# Altium schematic sheet RadioPod_3.SchDoc
size A4
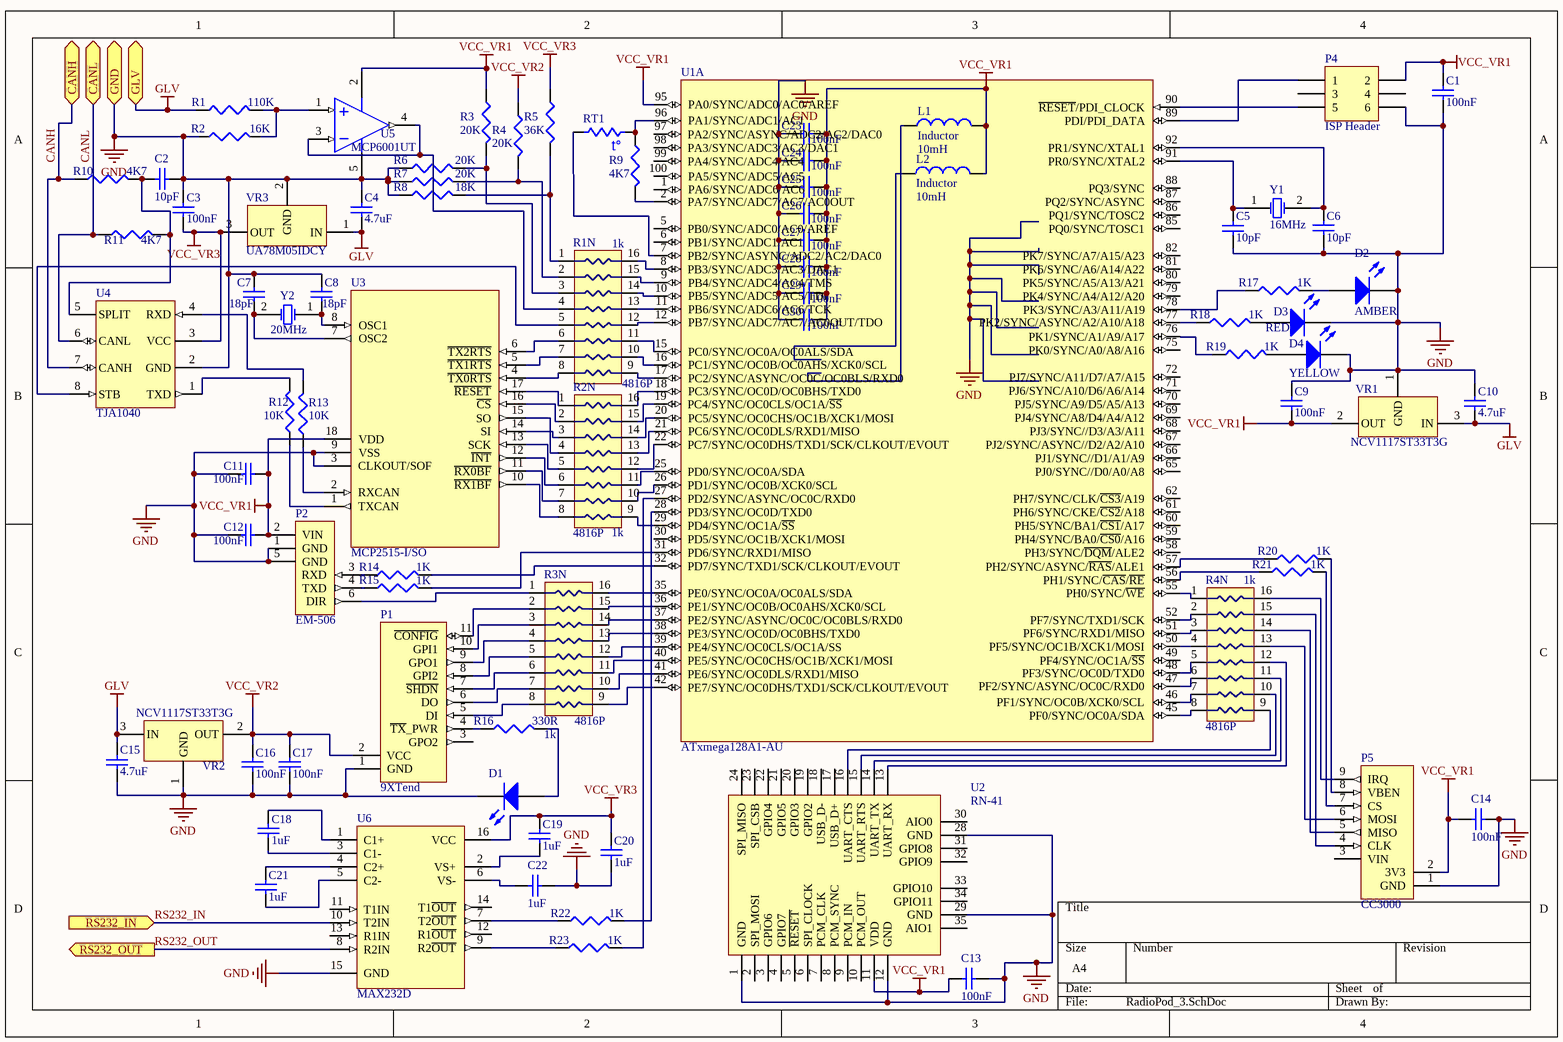
[diagram p0: RadioPod_3.SchDoc]

## Parts
C1  value 100nF  [1608[0603]]  (hidden comment: Cap Semi)
C2  value 10pF  [1608[0603]]  (hidden comment: Cap Semi)
C3  value 100nF  [1608[0603]]  (hidden comment: Cap Semi)
C4  value 4.7uF  [1608[0603]]  (hidden comment: Cap Semi)
C5  value 10pF  [1608[0603]]  (hidden comment: Cap Semi)
C6  value 10pF  [1608[0603]]  (hidden comment: Cap Semi)
C7  value 18pF  [1608[0603]]  (hidden comment: Cap Semi)
C8  value 18pF  [1608[0603]]  (hidden comment: Cap Semi)
C9  value 100nF  [1608[0603]]  (hidden comment: Cap Semi)
C10  value 4.7uF  [1608[0603]]  (hidden comment: Cap Semi)
C11  value 100nF  [1608[0603]]  (hidden comment: Cap Semi)
C12  value 100nF  [1608[0603]]  (hidden comment: Cap Semi)
C13  value 100nF  [1608[0603]]  (hidden comment: Cap Semi)
C14  value 100nF  [1608[0603]]  (hidden comment: Cap Semi)
C15  value 4.7uF  [1608[0603]]  (hidden comment: Cap Semi)
C16  value 100nF  [1608[0603]]  (hidden comment: Cap Semi)
C17  value 100nF  [1608[0603]]  (hidden comment: Cap Semi)
C18  value 1uF  [1608[0603]]  (hidden comment: Cap Semi)
C19  value 1uF  [1608[0603]]  (hidden comment: Cap Semi)
C20  value 1uF  [1608[0603]]  (hidden comment: Cap Semi)
C21  value 1uF  [1608[0603]]  (hidden comment: Cap Semi)
C22  value 1uF  [1608[0603]]  (hidden comment: Cap Semi)
C23  value 100nF  [1608[0603]]  (hidden comment: Cap Semi)
C24  value 100nF  [1608[0603]]  (hidden comment: Cap Semi)
C25  value 100nF  [1608[0603]]  (hidden comment: Cap Semi)
C26  value 100nF  [1608[0603]]  (hidden comment: Cap Semi)
C27  value 100nF  [1608[0603]]  (hidden comment: Cap Semi)
C28  value 100nF  [1608[0603]]  (hidden comment: Cap Semi)
C29  value 100nF  [1608[0603]]  (hidden comment: Cap Semi)
C30  value 100nF  [1608[0603]]  (hidden comment: Cap Semi)
D1  LED2  [2012[0805]_LED]  (value not drawn)
D2  AMBER  [hdr1x2]
D3  RED  [2012[0805]_LED]
D4  YELLOW  [2012[0805]_LED]
L1  Inductor  value 10mH  [2012[0805]_IND]
L2  Inductor  value 10mH  [2012[0805]_IND]
P1  9XTend  [9XTend Header]
P2  EM-506  [EM_506]
P4  ISP Header  [ISP Header]
P5  CC3000  [hdr1X9]
R1  value 110K  [2012[0805]_RES]  (hidden comment: Res3)
R1N  4816P  Resistance: 1k  [SOIC16_L]
R2  value 16K  [2012[0805]_RES]  (hidden comment: Res3)
R2N  4816P  Resistance: 1k  [SOIC16_L]
R3  value 20K  [2012[0805]_RES]  (hidden comment: Res3)
R3N  4816P  Resistance: 1k  [SOIC16_L]
R4  value 20K  [2012[0805]_RES]  (hidden comment: Res3)
R4N  4816P  Resistance: 1k  [SOIC16_L]
R5  value 36K  [2012[0805]_RES]  (hidden comment: Res3)
R6  value 20K  [2012[0805]_RES]  (hidden comment: Res3)
R7  value 20K  [2012[0805]_RES]  (hidden comment: Res3)
R8  value 18K  [2012[0805]_RES]  (hidden comment: Res3)
R9  value 4K7  [2012[0805]_RES]  (hidden comment: Res3)
R10  value 4K7  [2012[0805]_RES]  (hidden comment: Res3)
R11  value 4K7  [2012[0805]_RES]  (hidden comment: Res3)
R12  value 10K  [2012[0805]_RES]  (hidden comment: Res3)
R13  value 10K  [2012[0805]_RES]  (hidden comment: Res3)
R14  value 1K  [2012[0805]_RES]  (hidden comment: Res3)
R15  value 1K  [2012[0805]_RES]  (hidden comment: Res3)
R16  value 330R  [2012[0805]_RES]  (hidden comment: Res3)
R17  value 1K  [2012[0805]_RES]  (hidden comment: Res3)
R18  value 1K  [2012[0805]_RES]  (hidden comment: Res3)
R19  value 1K  [2012[0805]_RES]  (hidden comment: Res3)
R20  value 1K  [2012[0805]_RES]  (hidden comment: Res3)
R21  value 1K  [2012[0805]_RES]  (hidden comment: Res3)
R22  value 1K  [2012[0805]_RES]  (hidden comment: Res3)
R23  value 1K  [2012[0805]_RES]  (hidden comment: Res3)
RT1  Res Thermal  [2012[0805]_RES]  (value not drawn)
U1  ATxmega128A1-AU  [100A_N]  (part A of 2)
U2  RN-41  [RN41]
U3  MCP2515-I/SO  [SOIC-SO18_N]
U4  TJA1040  [SO8_L]
U5  MCP6001UT  [SOT-23-OT5_N]
U6  MAX232D  [D016_M]
VR1  NCV1117ST33T3G  [SOT223_L]
VR2  NCV1117ST33T3G  [SOT223_L]
VR3  UA78M05IDCY  [SOT223_L]
Y1  16MHz  [Crystal]
Y2  20MHz  [MCP2515_XTAL]

## Ports
CANH (bidir), CANL (bidir), GLV, GND, RS232_IN (in), RS232_OUT (out)

## Nets
GLV: C4.1 C10.1 C15.2 R1.1 VR1.3(IN) VR2.3(IN) VR3.1(IN) ; port GLV
GND: C1.1 C2.1 C3.2 C4.2 C5.2 C6.2 C7.2 C8.2 C9.2 C10.2 C11.2 C12.2 C13.2 C14.2 C15.1 C16.1 C17.1 C20.1 C22.1 C23.2 C24.2 C25.2 C26.2 C27.2 C28.2 C29.2 C30.2 D1.2(K) D2.2(K) D3.2(K) D4.2(K) P1.1(GND) P2.1(GND) P2.5(GND) P4.6 P5.1(GND) R2.1 R6.1 R7.1 R8.1 U2.1(GND) U2.12(GND) U2.28(GND) U2.29(GND) U3.3(CLKOUT/SOF) U3.9(VSS) U4.2(GND) U5.5(VDD) U6.15(GND) VR1.1(GND) VR2.1(GND) VR3.2(GND) ; port GND
VCC_VR1: C1.2 C9.1 C11.1 C12.1 C13.1 C14.1 C23.1 C24.1 C25.1 C26.1 C27.1 C28.1 C29.1 C30.1 L1.2 L2.2 P2.2(VIN) P4.2 P5.2(3V3) R3.1 U1.95(PA0/SYNC/ADC0/AC0/AREF) U2.11(VDD) U3.18(VDD) U5.2(VSS) VR1.2(OUT)
VCC_VR2: C16.2 C17.2 P1.2(VCC) R4.1 VR2.2(OUT)
VCC_VR3: C3.1 C19.2 C20.2 R5.1 U4.3(VCC) U6.16(VCC) VR3.3(OUT)
CANH: R10.1 U4.7(CANH) ; port CANH
CANL: R11.1 U4.6(CANL) ; port CANL
RS232_IN: U6.10(T2IN) ; port RS232_IN
RS232_OUT: U6.8(R2IN) ; port RS232_OUT
NetC2_2: C2.2 R10.2 R11.2 U4.5(SPLIT)
NetC5_1: C5.1 U1.91(PR0/SYNC/XTAL2) Y1.1(OSC1)
NetC6_1: C6.1 U1.92(PR1/SYNC/XTAL1) Y1.2(OSC2)
NetC7_1: C7.1 U3.7(OSC2) Y2.2(OSC2)
NetC8_1: C8.1 U3.8(OSC1) Y2.1(OSC1)
NetC18_1: C18.1 U6.3(C1-)
NetC18_2: C18.2 U6.1(C1+)
NetC19_1: C19.1 U6.2(VS+)
NetC21_1: C21.1 U6.5(C2-)
NetC21_2: C21.2 U6.4(C2+)
NetC22_2: C22.2 U6.6(VS-)
NetD1_1: D1.1(A) R16.2
NetD2_1: D2.1(A) R17.2
NetD3_1: D3.1(A) R18.2
NetD4_1: D4.1(A) R19.2
NetP1_4: P1.4(~{TX}_PWR) R16.1
NetP1_5: P1.5(DI) R3N.8
NetP1_6: P1.6(DO) R3N.7
NetP1_7: P1.7(~{SHDN}) R3N.6
NetP1_8: P1.8(GPI2) R3N.5
NetP1_9: P1.9(GPO1) R3N.4
NetP1_10: P1.10(GPI1) R3N.3
NetP1_11: P1.11(~{CONFIG}) R3N.2
NetP2_3: P2.3(RXD) R14.1
NetP2_4: P2.4(TXD) R15.1
NetP2_6: P2.6(DIR) R3N.1
NetP4_1: P4.1 U1.89(PDI/PDI_DATA)
NetP4_5: P4.5 U1.90(~{RESET}/PDI_CLOCK)
NetP5_4: P5.4(CLK) R4N.15
NetP5_5: P5.5(MISO) R4N.14
NetP5_6: P5.6(MOSI) R4N.13
NetP5_7: P5.7(CS) R21.2
NetP5_8: P5.8(VBEN) R20.2
NetP5_9: P5.9(IRQ) R4N.16
NetR1_2: R1.2 R2.2 U5.1(VIN+)
NetR1N_1: R1N.1 R5.2 R8.2
NetR1N_2: R1N.2 R4.2 R7.2
NetR1N_3: R1N.3 R3.2 R6.2
NetR1N_4: R1N.4 U5.3(VIN-) U5.4(VOUT)
NetR1N_5: R1N.5 U4.8(STB)
NetR1N_6: R1N.6 U3.6(~{TX2RTS})
NetR1N_7: R1N.7 U3.5(~{TX1RTS})
NetR1N_8: R1N.8 U3.4(~{TX0RTS})
NetR1N_9: R1N.9 U1.17(PC2/SYNC/ASYNC/OC0C/OC0BLS/RXD0)
NetR1N_10: R1N.10 U1.16(PC1/SYNC/OC0B/OC0AHS/XCK0/SCL)
NetR1N_11: R1N.11 U1.15(PC0/SYNC/OC0A/OC0ALS/SDA)
NetR1N_12: R1N.12 U1.12(PB7/SYNC/ADC7/AC7/AC0OUT/TDO)
NetR1N_13: R1N.13 U1.11(PB6/SYNC/ADC6/AC6/TCK)
NetR1N_14: R1N.14 U1.10(PB5/SYNC/ADC5/AC5/TDI)
NetR1N_15: R1N.15 U1.9(PB4/SYNC/ADC4/AC4/TMS)
NetR1N_16: R1N.16 U1.8(PB3/SYNC/ADC3/AC3/DAC1)
NetR2N_1: R2N.1 U3.17(~{RESET})
NetR2N_2: R2N.2 U3.16(~{CS})
NetR2N_3: R2N.3 U3.14(SI)
NetR2N_4: R2N.4 U3.15(SO)
NetR2N_5: R2N.5 U3.13(SCK)
NetR2N_6: R2N.6 U3.12(~{INT})
NetR2N_7: R2N.7 U3.11(~{RX0BF})
NetR2N_8: R2N.8 U3.10(~{RX1BF})
NetR2N_9: R2N.9 U1.29(PD4/SYNC/OC1A/~{SS})
NetR2N_10: R2N.10 U1.26(PD1/SYNC/OC0B/XCK0/SCL)
NetR2N_11: R2N.11 U1.25(PD0/SYNC/OC0A/SDA)
NetR2N_12: R2N.12 U1.22(PC7/SYNC/OC0DHS/TXD1/SCK/CLKOUT/EVOUT)
NetR2N_13: R2N.13 U1.21(PC6/SYNC/OC0DLS/RXD1/MISO)
NetR2N_14: R2N.14 U1.20(PC5/SYNC/OC0CHS/OC1B/XCK1/MOSI)
NetR2N_15: R2N.15 U1.19(PC4/SYNC/OC0CLS/OC1A/~{SS})
NetR2N_16: R2N.16 U1.18(PC3/SYNC/OC0D/OC0BHS/TXD0)
NetR3N_9: R3N.9 U1.42(PE7/SYNC/OC0DHS/TXD1/SCK/CLKOUT/EVOUT)
NetR3N_10: R3N.10 U1.41(PE6/SYNC/OC0DLS/RXD1/MISO)
NetR3N_11: R3N.11 U1.40(PE5/SYNC/OC0CHS/OC1B/XCK1/MOSI)
NetR3N_12: R3N.12 U1.39(PE4/SYNC/OC0CLS/OC1A/SS)
NetR3N_13: R3N.13 U1.38(PE3/SYNC/OC0D/OC0BHS/TXD0)
NetR3N_14: R3N.14 U1.37(PE2/SYNC/ASYNC/OC0C/OC0BLS/RXD0)
NetR3N_15: R3N.15 U1.36(PE1/SYNC/OC0B/OC0AHS/XCK0/SCL)
NetR3N_16: R3N.16 U1.35(PE0/SYNC/OC0A/OC0ALS/SDA)
NetR4N_1: R4N.1 U1.55(PH0/SYNC/~{WE})
NetR4N_2: R4N.2 U1.52(PF7/SYNC/TXD1/SCK)
NetR4N_3: R4N.3 U1.51(PF6/SYNC/RXD1/MISO)
NetR4N_4: R4N.4 U1.50(PF5/SYNC/OC1B/XCK1/MOSI)
NetR4N_5: R4N.5 U1.48(PF3/SYNC/OC0D/TXD0)
NetR4N_6: R4N.6 U1.47(PF2/SYNC/ASYNC/OC0C/RXD0)
NetR4N_7: R4N.7 U1.46(PF1/SYNC/OC0B/XCK0/SCL)
NetR4N_8: R4N.8 U1.45(PF0/SYNC/OC0A/SDA)
NetR4N_9: R4N.9 U2.16(UART_CTS)
NetR4N_10: R4N.10 U2.15(UART_RTS)
NetR4N_11: R4N.11 U2.14(UART_TX)
NetR4N_12: R4N.12 U2.13(UART_RX)
NetR9_1: R9.1 RT1.1 U1.96(PA1/SYNC/ADC1/AC1)
NetR9_2: R9.2 U1.2(PA7/SYNC/ADC7/AC7/AC0OUT)
NetR12_1: R12.1 U3.1(TXCAN)
NetR12_2: R12.2 U4.1(TXD)
NetR13_1: R13.1 U3.2(RXCAN)
NetR13_2: R13.2 U4.4(RXD)
NetR14_2: R14.2 U1.32(PD7/SYNC/TXD1/SCK/CLKOUT/EVOUT)
NetR15_2: R15.2 U1.31(PD6/SYNC/RXD1/MISO)
NetR17_1: R17.1 U1.78(PK3/SYNC/A3/A11/A19)
NetR18_1: R18.1 U1.77(PK2/SYNC/ASYNC/A2/A10/A18)
NetR19_1: R19.1 U1.76(PK1/SYNC/A1/A9/A17)
NetR20_1: R20.1 U1.57(PH2/SYNC/ASYNC/~{RAS}/ALE1)
NetR21_1: R21.1 U1.56(PH1/SYNC/~{CAS}/~{RE})
NetR22_1: R22.1 U6.7(T2~{OUT})
NetR22_2: R22.2 U1.28(PD3/SYNC/OC0D/TXD0)
NetR23_1: R23.1 U6.9(R2~{OUT})
NetR23_2: R23.2 U1.27(PD2/SYNC/ASYNC/OC0C/RXD0)
NetRT1_2: RT1.2 U1.7(PB2/SYNC/ASYNC/ADC2/AC2/DAC0)

Not connected (* = marked no-connect by the designer): L1 1; L2 1; P1 3(GPO2); P4 3 4; P5 3(VIN); U1 1(PA6/SYNC/ADC6/AC6) 5(PB0/SYNC/ADC0/AC0/AREF) 6(PB1/SYNC/ADC1/AC1) 30(PD5/SYNC/OC1B/XCK1/MOSI) 49(PF4/SYNC/OC1A/~{SS}) 58(PH3/SYNC/~{DQM}/ALE2) 59(PH4/SYNC/BA0/~{CS0}/A16) 60(PH5/SYNC/BA1/~{CS1}/A17) 61(PH6/SYNC/CKE/~{CS2}/A18) 62(PH7/SYNC/CLK/~{CS3}/A19) 65(PJ0/SYNC//D0/A0/A8) 66(PJ1/SYNC//D1/A1/A9) 67(PJ2/SYNC/ASYNC//D2/A2/A10) 68(PJ3/SYNC//D3/A3/A11) 69(PJ4/SYNC/A8/D4/A4/A12) 70(PJ5/SYNC/A9/D5/A5/A13) 71(PJ6/SYNC/A10/D6/A6/A14) 72(PJ7/SYNC/A11/D7/A7/A15) 75(PK0/SYNC/A0/A8/A16) 79(PK4/SYNC/A4/A12/A20) 80(PK5/SYNC/A5/A13/A21) 81(PK6/SYNC/A6/A14/A22) 82(PK7/SYNC/A7/A15/A23) 85(PQ0/SYNC/TOSC1) 86(PQ1/SYNC/TOSC2) 87(PQ2/SYNC/ASYNC) 88(PQ3/SYNC) 97(PA2/SYNC/ASYNC/ADC2/AC2/DAC0) 98(PA3/SYNC/ADC3/AC3/DAC1) 99(PA4/SYNC/ADC4/AC4) 100(PA5/SYNC/ADC5/AC5); U2 2(SPI_MOSI) 3(GPIO6) 4(GPIO7) 5(~{RESET}) 6(SPI_CLOCK) 7(PCM_CLK) 8(PCM_SYNC) 9(PCM_IN) 10(PCM_OUT) 17(USB_D+) 18(USB_D-) 19(GPIO2) 20(GPIO3) 21(GPIO5) 22(GPIO4) 23(SPI_CSB) 24(SPI_MISO) 30(AIO0) 31(GPIO8) 32(GPIO9) 33(GPIO10) 34(GPIO11) 35(AIO1); U6 11(T1IN) 12(R1~{OUT}) 13(R1IN) 14(T1~{OUT}); VR1 4; VR2 4; VR3 4(GND)

## Notes on the sheet
- (in symbol Res Thermal) t°

## Library data of the parts
C1-C30 = Cap Semi: Capacitor (Semiconductor SIM Model); Published: 8-Jun-2000; LatestRevisionDate: 29-May-2009; LatestRevisionNote: IPC-7351 Footprint Added.; PackageReference: C1206; Publisher: Altium Limited; PackageDescription: Chip Capacitor
D1 D3 D4 = LED2: Typical RED, GREEN, YELLOW, AMBER GaAs LED; Published: 8-Jun-2000; LatestRevisionDate: 17-Jul-2002; LatestRevisionNote: Re-released for DXP Platform.; PackageVersion: Feb-2002; PackageReference: 3.2X1.6X1.1; Publisher: Altium Limited; PackageDescription: SM LED; 2 Flat Leads
D2 = LED0: Typical INFRARED GaAs LED; Published: 8-Jun-2000; LatestRevisionDate: 08-Jul-2005; LatestRevisionNote: Mech Layer 1 removed.; PackageReference: LED-0; Publisher: Altium Limited; PackageDescription: LED; 2 Leads
L1 L2 = Inductor: Code_IEC: 1005; Published: 8-Jun-2000; LatestRevisionDate: 29-May-2009; LatestRevisionNote: IPC-7351 Footprint Added.; PackageReference: 0402-A; Publisher: Altium Limited; PackageDescription: Chip Inductor; Code_JEITA: 0402
P1 = 9XTend: 9XTend Header Pins
P2 = EM-506: EM-506 GPS Module Pads
P4 = Header 3X2: Header, 3-Pin, Dual row; LatestRevisionDate: 17-Jul-2002; LatestRevisionNote: Re-released for DXP Platform.; Publisher: Altium Limited
P5 = CC3000: CC3000 Wifi Module
R1-R23 = Res3: Resistor; Published: 8-Jun-2000; LatestRevisionDate: 29-May-2009; LatestRevisionNote: IPC-7351 Footprint Added.; PackageReference: J1-0603; Publisher: Altium Limited; PackageDescription: Chip Resistor
R1N R2N R3N R4N = 4816P: Resistor Network SOIC-16 package
RT1 = Res Thermal: Thermistor; Published: 24-Mar-1999; LatestRevisionDate: 29-May-2009; LatestRevisionNote: IPC-7351 Footprint Added.; PackageVersion: Mar-2003; PackageReference: 6-0805; Publisher: Altium Limited; PackageDescription: Chip Resistor 0805 Case Size; Code_IPC: RESC2012
U1 = ATxmega128A1-AU: 8/16-bit AVR XMEGA A1 Microcontroller, 1.6-3.6V, 128KB + 8KB Flash, 2KB EEPROM, 8KB SRAM, 100-pin TQFP, Industrial Grade (-40°C to 85°C), Pb-Free; Published: 1-Apr-2010; DatasheetVersion: revK, Feb-2010; PackageVersion: revC, Oct-2001; PackageReference: 100A; Publisher: Altium Limited; PackageDescription: 100-Pin Thin Profile Plastic Quad Flat Pack (TQFP), 14 x 14 x 1.0 mm Body, 0.5 mm Pitch; Supplier 1: Digi-Key; Supplier Part Number 1: ATXMEGA128A1-AU-ND; Supplier 2: Farnell; Supplier Part Number 2: 1704571; Supplier 3: Mouser; Supplier Part Number 3: 556-ATXMEGA128A1-AU; Code_JEDEC: MS-026-AED; ComponentLink1Description: Manufacturer Link; ComponentLink1URL: http://www.atmel.com/products/avr/default.asp?; ComponentLink2Description: ATxmega64A1/128A1/192A1/256A1/384A1 Datasheet; ComponentLink2URL: http://www.atmel.com/dyn/resources/prod_documents/doc8067.pdf; ComponentLink3Description: Atmel.com Home; ComponentLink3URL: http://www.atmel.com
U2 = RN41: RN-41 Bluetooth Module
U3 = MCP2515-I/SO: Stand-Alone CAN Controller With SPI Interface, 18-Pin SOIC, Industrial Temperature; Published: 29-Jan-2009; DatasheetVersion: revE, Nov-2007; PackageVersion: revBB, Aug-2009; PackageReference: SOIC-SO18; Publisher: Altium Limited; PackageDescription: 18-Lead Plastic Small Outline (SO) - Wide 7.50mm Body [SOIC]; Supplier 1: Digi-Key; Supplier Part Number 1: MCP2515-I/SO-ND; Supplier 2: Farnell; Supplier Part Number 2: 1292239; Code_JEDEC: MS-013; ComponentLink1Description: Datasheet; ComponentLink1URL: http://ww1.microchip.com/downloads/en/DeviceDoc/21801e.pdf; ComponentLink2Description: Packaging Specification; ComponentLink2URL: http://www.microchip.com/stellent/groups/techpub_sg/documents/packagingspec/en012702.pdf; ComponentLink3Description: Microchip.com Home; ComponentLink3URL: http://www.microchip.com/
U5 = MCP6001UT-I/OT: 1 MHz, Low-Power Operational Amplifier, 5-Pin SOT-23, Industrial Temperature, Tape and Reel; Published: 29-Jan-2009; LatestRevisionDate: 02-Dec-2009; LatestRevisionNote: Updated to datasheet revision J, Nov-2009; DatasheetVersion: revJ, Nov-2009; PackageVersion: revBB, Aug-2009; PackageReference: SOT-23-OT5; Publisher: Altium Limited; PackageDescription: 5-Lead Plastic Small Outline Transistor (OT) [SOT-23]; Supplier 1: Digi-Key; Supplier Part Number 1: MCP6001UT-I/OTTR-ND; Supplier 2: Digi-Key; Supplier Part Number 2: MCP6001UT-I/OTCT-ND; Supplier 3: Digi-Key; Supplier Part Number 3: MCP6001UT-I/OTDKR-ND; Supplier 4: Farnell; Supplier Part Number 4: 8540845; Code_IPC: SOT23-5; ComponentLink1Description: Datasheet; ComponentLink1URL: http://ww1.microchip.com/downloads/en/DeviceDoc/21733j.pdf; ComponentLink2Description: Packaging Specification; ComponentLink2URL: http://www.microchip.com/stellent/groups/techpub_sg/documents/packagingspec/en012702.pdf; ComponentLink3Description: Microchip.com Home; ComponentLink3URL: http://www.microchip.com/
U6 = MAX232D: Dual EIA-232 Driver/Receiver; Note: Receivers have typical hysteresis of 0.5V; Published: 15-May-2002; LatestRevisionDate: 13-Apr-2006; LatestRevisionNote: IPC-7351 Footprint Added.; DatasheetVersion: Jun-1989; PackageVersion: Jan-1998; PackageReference: D016; Publisher: Altium Limited; PackageDescription: 16-Pin Small Outline Integrated Circuit 1.27 mm Pitch; Code_IPC: SOIC127P600-16; ComponentLink1Description: Manufacturer Link; ComponentLink1URL: http://www.ti.com/; ComponentLink2Description: Datasheet; ComponentLink2URL: http://www-s.ti.com/sc/ds/max232.pdf
Y1 Y2 = XTAL: Crystal Oscillator; Published: 8-Jun-2000; LatestRevisionDate: 17-Jul-2002; LatestRevisionNote: Re-released for DXP Platform.; PackageReference: R38; Publisher: Altium Limited; PackageDescription: Crystal, Thru-Hole; 2 Leads; Body 3.1 x 8.2 mm (Dia.xH)
VR1 VR2 = NCV1117ST33T3G: Package Description: SOT−223
VR3 = UA78M05IDCY: Package Description: SOT−223